# EAGLE design Dual LPF V1.2 Top (EAGLE 9.0.0)
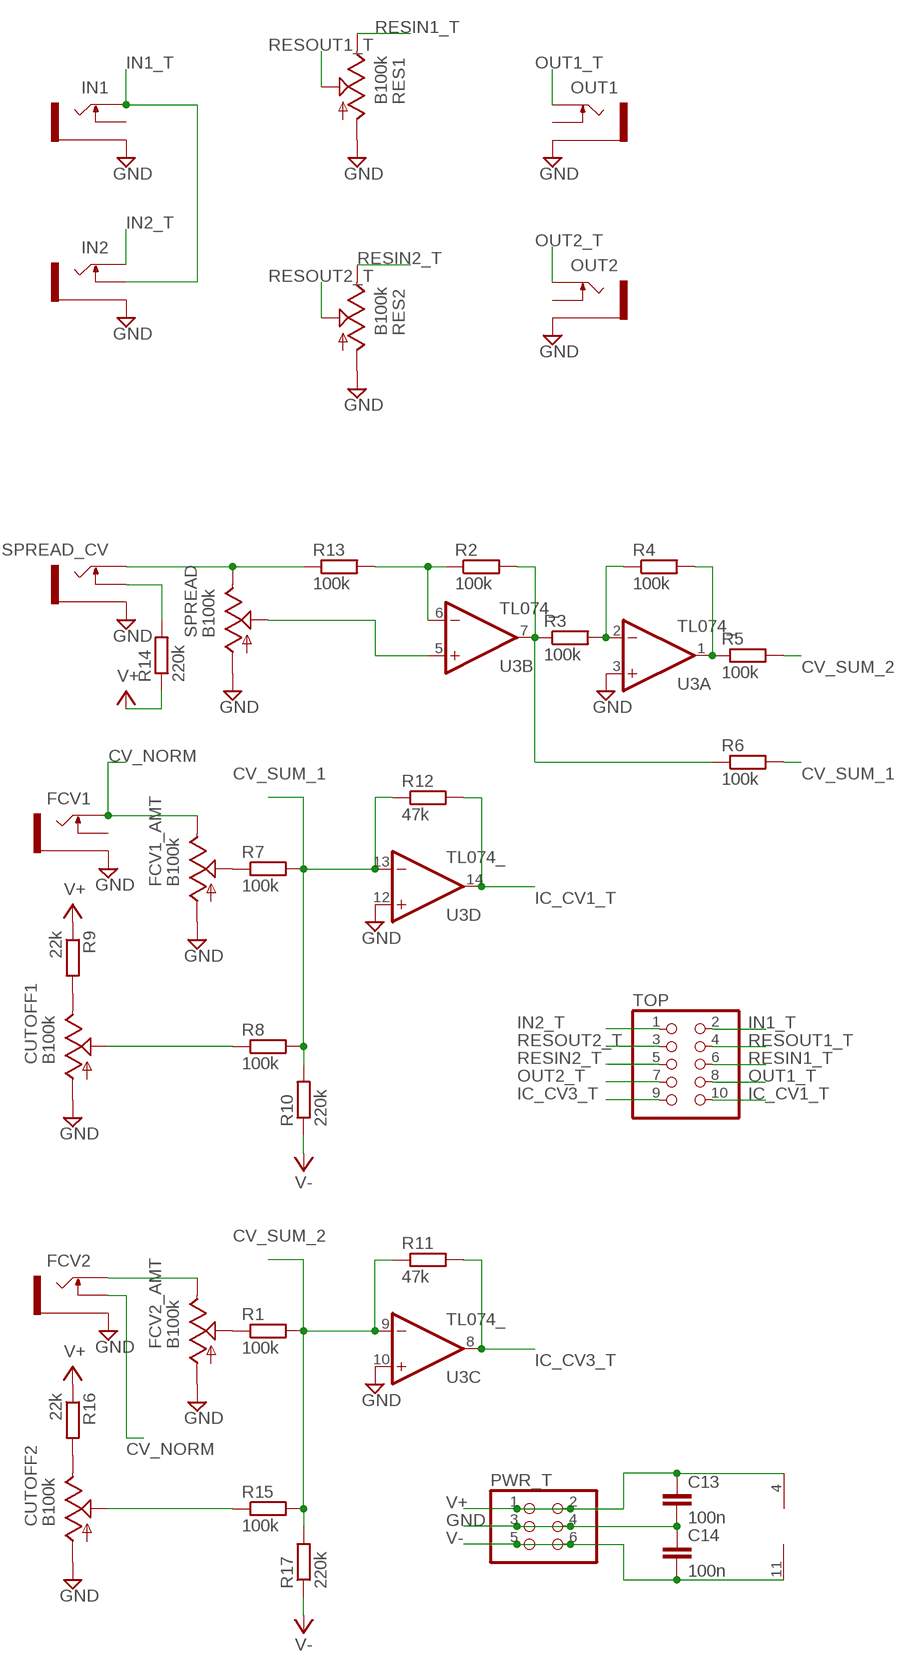
[diagram p0: schematic, sheet 1]

## Parts
C13  100n  C-EU050-024X044  [C050-024X044]
C14  100n  C-EU050-024X044  [C050-024X044]
CUTOFF1  B100k  9MM_SNAP-IN_POT_  [9MM_SNAP-IN_POT]
CUTOFF2  B100k  9MM_SNAP-IN_POT_  [9MM_SNAP-IN_POT]
FCV1  THONKICONNNEW  [WQP-PJ301M-12_JACK]
FCV1_AMT  B100k  9MM_SNAP-IN_POT_  [9MM_SNAP-IN_POT]
FCV2  THONKICONNNEW  [WQP-PJ301M-12_JACK]
FCV2_AMT  B100k  9MM_SNAP-IN_POT_  [9MM_SNAP-IN_POT]
IN1  THONKICONNNEW  [WQP-PJ301M-12_JACK]
IN2  THONKICONNNEW  [WQP-PJ301M-12_JACK]
OUT1  THONKICONNNEW  [WQP-PJ301M-12_JACK]
OUT2  THONKICONNNEW  [WQP-PJ301M-12_JACK]
PWR_T  PINHD-2X3  [2X03]
R1  100k  R-EU_0207/7  [0207/7]
R2  100k  R-EU_0207/7  [0207/7]
R3  100k  R-EU_0207/7  [0207/7]
R4  100k  R-EU_0207/7  [0207/7]
R5  100k  R-EU_0207/7  [0207/7]
R6  100k  R-EU_0207/7  [0207/7]
R7  100k  R-EU_0207/7  [0207/7]
R8  100k  R-EU_0207/7  [0207/7]
R9  22k  R-EU_0207/7  [0207/7]
R10  220k  R-EU_0207/7  [0207/7]
R11  47k  R-EU_0207/7  [0207/7]
R12  47k  R-EU_0207/7  [0207/7]
R13  100k  R-EU_0207/7  [0207/7]
R14  220k  R-EU_0207/7  [0207/7]
R15  100k  R-EU_0207/7  [0207/7]
R16  22k  R-EU_0207/7  [0207/7]
R17  220k  R-EU_0207/7  [0207/7]
RES1  B100k  9MM_SNAP-IN_POT_  [9MM_SNAP-IN_POT]
RES2  B100k  9MM_SNAP-IN_POT_  [9MM_SNAP-IN_POT]
SPREAD  B100k  9MM_SNAP-IN_POT_  [9MM_SNAP-IN_POT]
SPREAD_CV  THONKICONNNEW  [WQP-PJ301M-12_JACK]
TOP  PINHD-2X5  [2X05]
U3  TL074_  [DIL14]

## Nets
CV_NORM: FCV1.P$1_TIP(TIP) FCV1_AMT.3(E) FCV2.P$2_SWITCH(SWITCH)
CV_SUM_1: R6.2 R7.2 R8.2 R10.2 R12.1 U3.13(D:-IN)
CV_SUM_2: R1.2 R5.2 R11.1 R15.2 R17.2 U3.9(C:-IN)
GND: C13.2 C14.1 CUTOFF1.1(A) CUTOFF2.1(A) FCV1.P$3_SLEEVE(SLEEVE) FCV1_AMT.1(A) FCV2.P$3_SLEEVE(SLEEVE) FCV2_AMT.1(A) IN1.P$3_SLEEVE(SLEEVE) IN2.P$3_SLEEVE(SLEEVE) OUT1.P$3_SLEEVE(SLEEVE) OUT2.P$3_SLEEVE(SLEEVE) PWR_T.3 PWR_T.4 RES1.1(A) RES2.1(A) SPREAD.1(A) SPREAD_CV.P$3_SLEEVE(SLEEVE) U3.3(A:+IN) U3.10(C:+IN) U3.12(D:+IN)
IC_CV1_T: R12.2 TOP.10 U3.14(D:OUT)
IC_CV3_T: R11.2 TOP.9 U3.8(C:OUT)
IN1_T: IN1.P$1_TIP(TIP) IN2.P$2_SWITCH(SWITCH) TOP.2
IN2_T: IN2.P$1_TIP(TIP) TOP.1
N$1: FCV2_AMT.2(S) R1.1
N$2: R2.1 R13.2 U3.6(B:-IN)
N$3: R2.2 R3.1 R6.1 U3.7(B:OUT)
N$4: R3.2 R4.1 U3.2(A:-IN)
N$5: R4.2 R5.1 U3.1(A:OUT)
N$6: R14.2 SPREAD_CV.P$2_SWITCH(SWITCH)
N$7: SPREAD.2(S) U3.5(B:+IN)
N$8: R13.1 SPREAD.3(E) SPREAD_CV.P$1_TIP(TIP)
N$9: FCV1_AMT.2(S) R7.1
N$10: CUTOFF1.2(S) R8.1
N$12: CUTOFF1.3(E) R9.2
N$15: CUTOFF2.2(S) R15.1
N$16: CUTOFF2.3(E) R16.2
N$17: FCV2.P$1_TIP(TIP) FCV2_AMT.3(E)
OUT1_T: OUT1.P$1_TIP(TIP) TOP.8
OUT2_T: OUT2.P$1_TIP(TIP) TOP.7
RESIN1_T: RES1.3(E) TOP.6
RESIN2_T: RES2.3(E) TOP.5
RESOUT1_T: RES1.2(S) TOP.4
RESOUT2_T: RES2.2(S) TOP.3
V+: C13.1 PWR_T.1 PWR_T.2 R9.1 R14.1 R16.1 U3.4(P:V+)
V-: C14.2 PWR_T.5 PWR_T.6 R10.1 R17.1 U3.11(P:V-)
Unconnected: FCV1.P$2_SWITCH(SWITCH) IN1.P$2_SWITCH(SWITCH) OUT1.P$2_SWITCH(SWITCH) OUT2.P$2_SWITCH(SWITCH)

## Library data of the parts
C13 C14 = resistor:C-EU: CAPACITOR, European symbol
CUTOFF1 CUTOFF2 FCV1_AMT FCV2_AMT RES1 RES2 SPREAD = MusicThingModular:9MM_SNAP-IN_POT: 9mm vertical snap-in pot, Alpha / Panasonic style
FCV1 FCV2 IN1 IN2 OUT1 OUT2 SPREAD_CV = MusicThingModular:THONKICONN: 3.5mm socket for Eurorack modular synths
PWR_T = pinhead:PINHD-2X3: PIN HEADER
R1-R17 = resistor:R-EU_: RESISTOR, European symbol
TOP = pinhead:PINHD-2X5: PIN HEADER
U3 = MusicThingModular:TL074: Generic Quad Op Amp

## Board
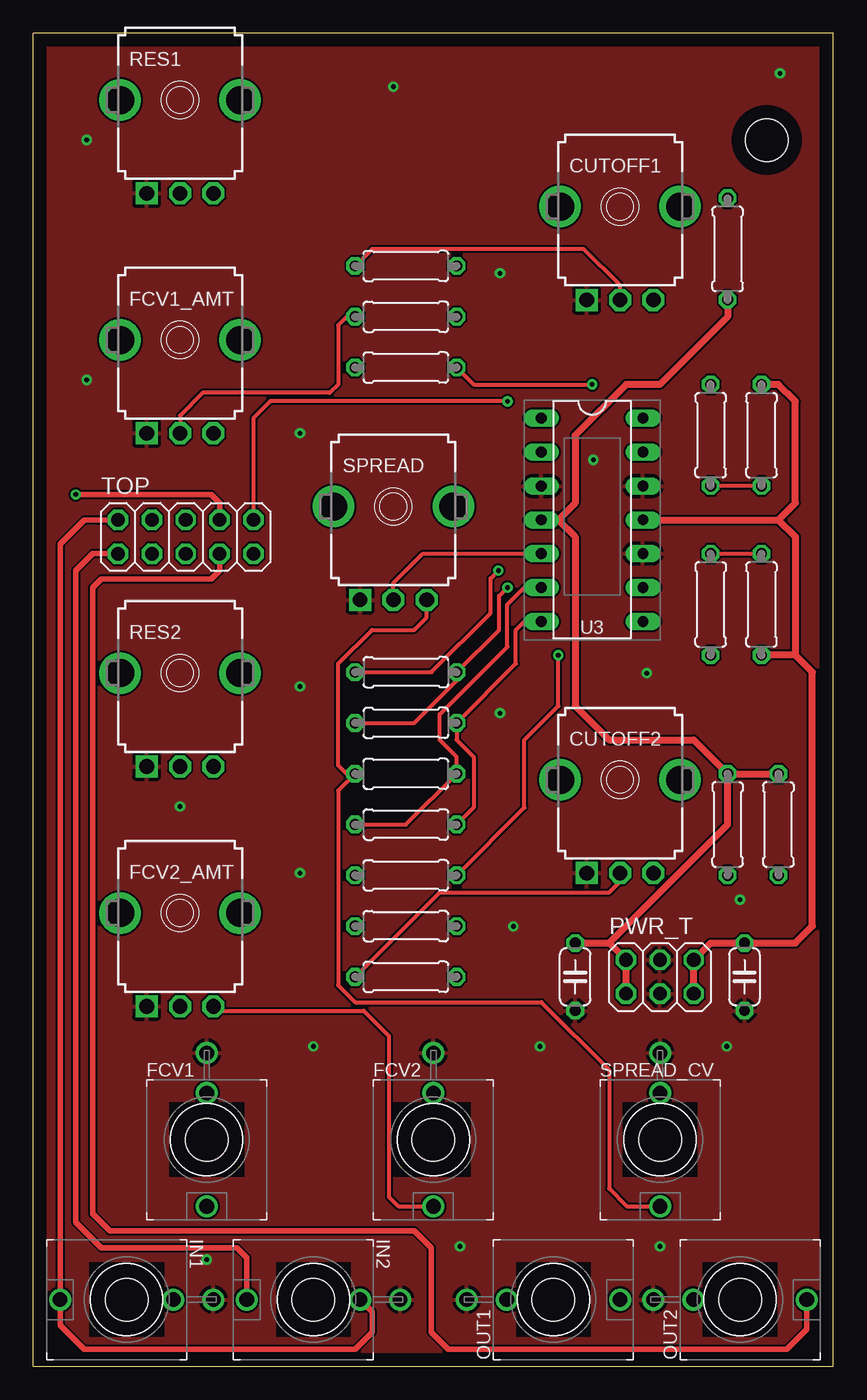
[diagram p1: board, top side]
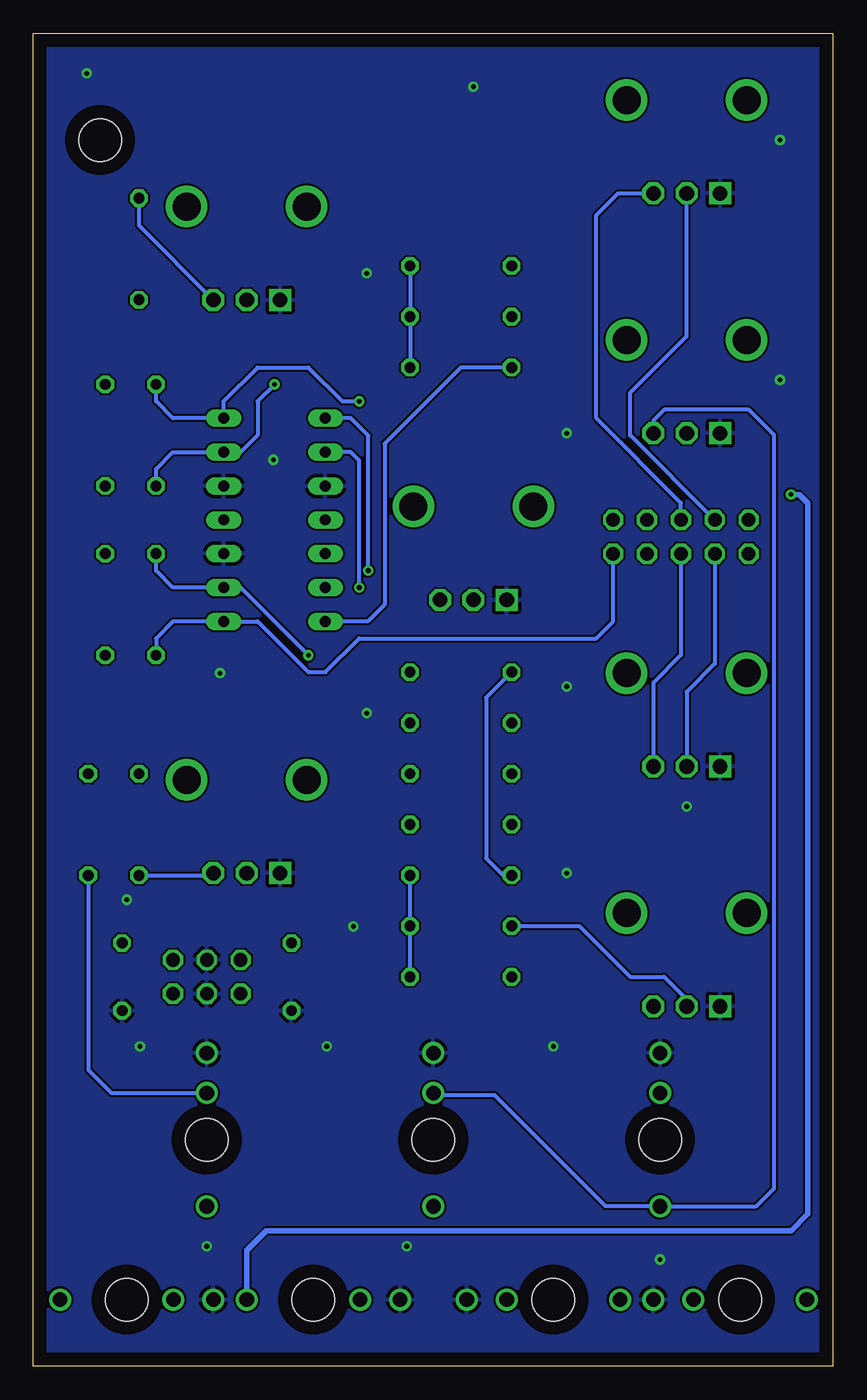
[diagram p2: board, bottom side, seen from below]

Size 60 x 100 mm. Coordinates in mm from the lower left corner, seen from the top.
Outline: 0,0 60,0 60,100 0,100 0,0
Copper layers (1*16): Top 0.035mm / dielectric 1.5mm / Bottom 0.035mm
Design rules "default": minimum track width 6mil, minimum drill 0.35mm, track to track 6mil, track to pad 6mil, pad to pad 6mil, via to via 6mil, smd to smd 6mil, copper to edge 40mil, drill to drill 6mil, minimum pad ring 10mil, minimum via ring 8mil, stop-mask expansion 4mil, vias tented up to drill 0mil, thermal gap 10mil
Holes 3.2 mm at 13,17 30,17 47,17 53,5 39,5 21,5 7,5 55,92

### Footprints (pad centres in the part's own frame; a part is rotated, then mirrored left to right if it is on the bottom)
C050-024X044 = drill 0.813 octagon: 1 -2.54,0; 2 2.54,0
9MM_SNAP-IN_POT = drill 1.1 square: 1 -2.5,-7 | drill 1.1 octagon: 2 0,-7; 3 2.5,-7 | drill 2.1 pad 2.794: CHASSIS1 -4.5,0; CHASSIS2 4.5,0
WQP-PJ301M-12_JACK = drill 1.1: P$1_TIP 0,5; P$2_SWITCH 0,-3.5; P$3_SLEEVE 0,-6.5
2X03 = drill 1.016 octagon: 1 -2.54,-1.27; 2 -2.54,1.27; 3 0,-1.27; 4 0,1.27; 5 2.54,-1.27; 6 2.54,1.27
0207/7 = drill 0.813 octagon: 1 -3.81,0; 2 3.81,0
2X05 = drill 1.016 octagon: 1 -5.08,-1.27; 2 -5.08,1.27; 3 -2.54,-1.27; 4 -2.54,1.27; 5 0,-1.27; 6 0,1.27; 7 2.54,-1.27; 8 2.54,1.27; 9 5.08,-1.27; 10 5.08,1.27
DIL14 = drill 0.813 long: 1 -7.62,-3.81; 2 -5.08,-3.81; 3 -2.54,-3.81; 4 0,-3.81; 5 2.54,-3.81; 6 5.08,-3.81; 7 7.62,-3.81; 8 7.62,3.81; 9 5.08,3.81; 10 2.54,3.81; 11 0,3.81; 12 -2.54,3.81; 13 -5.08,3.81; 14 -7.62,3.81

### Placement (x,y rotation side)
C13  40.64,29.21 270 top
C14  53.34,29.21 90 top
CUTOFF1  44,87 0 top
CUTOFF2  44,44 0 top
FCV1  13,17 180 top
FCV1_AMT  11,77 0 top
FCV2  30,17 180 top
FCV2_AMT  11,34 0 top
IN1  7,5 90 top
IN2  21,5 90 top
OUT1  39,5 270 top
OUT2  53,5 270 top
PWR_T  46.99,29.21 0 top
R1  27.94,33.02 0 top
R2  27.94,40.64 0 top
R3  27.94,48.26 180 top
R4  27.94,52.07 180 top
R5  27.94,36.83 0 top
R6  27.94,74.93 0 top
R7  27.94,78.74 0 top
R8  27.94,82.55 0 top
R9  52.07,83.82 90 top
R10  54.61,69.85 270 top
R11  50.8,57.15 270 top
R12  50.8,69.85 90 top
R13  27.94,44.45 0 top
R14  55.88,40.64 270 top
R15  27.94,29.21 0 top
R16  52.07,40.64 270 top
R17  54.61,57.15 90 top
RES1  11,95 0 top
RES2  11,52 0 top
SPREAD  27,64.5 0 top
SPREAD_CV  47,17 180 top
TOP  11.43,62.23 0 top
U3  41.91,63.5 270 top

### Tracks (layer width: path | path; a pad name or v marks a point on that pad's centre or on a via)
CV_NORM
  Bottom 0.305: FCV1_AMT.3 13.5,70.95 12.7,71.75 6.35,71.75 4.45,69.85 4.45,13.34 5.78,12 FCV1.P$1_TIP 17.08,12 25.4,20.32 29.82,20.32 FCV2.P$2_SWITCH
CV_SUM_1  (via drill 0.35)
  Top 0.305: R10.2 R12.1 | R6.2 33.02,73.66 v41.91,73.66
  Bottom 0.305: R12.1 50.8,67.31 49.53,68.58 U3.13 44.45,68.58 43.18,69.85 43.18,72.39 v41.91,73.66 | R8.2 R7.2 R6.2
CV_SUM_2  (via drill 0.35)
  Top 0.305: R11.1 R17.2 | R5.2 36.83,41.91 36.83,46.99 39.37,49.53 v39.37,53.34
  Bottom 0.305: R15.2 R1.2 R5.2 | R11.1 50.8,59.69 49.53,58.42 U3.9 44.45,58.42 v39.37,53.34
GND  (via drill 0.35)
  other vias: 21,24 38,24 52,24 47,9 32,9 13,8 11,42 4,74 4,92 56,97 35,82 35,49 46,52 20,51 20,37 36,33 53,35 20,70 27,96 42,68
  pour Top: 0,100 0,0 60,0 60,100
  pour Bottom: 0,100 0,0 60,0 60,100
IC_CV1_T  (via drill 0.35)
  Top 0.305: v35.56,72.39 17.78,72.39 16.51,71.12 TOP.10
  Bottom 0.305: R12.2 50.8,72.39 49.53,71.12 U3.14 45.72,72.39 43.18,74.93 39.37,74.93 36.83,72.39 v35.56,72.39
IC_CV3_T
  Bottom 0.305: R11.2 50.8,54.61 49.53,55.88 U3.8 43.18,55.88 39.37,52.07 38.1,52.07 35.56,54.61 17.78,54.61 16.51,55.88 TOP.9
IN1_T
  Top 0.406: IN2.P$2_SWITCH 25.4,4.1 25.4,2.54 24.13,1.27 3.81,1.27 2,3.08 IN1.P$1_TIP 2,61.69 3.81,63.5 TOP.2
IN2_T
  Top 0.406: IN2.P$1_TIP 16,8.13 15.24,8.89 5.08,8.89 3.17,10.79 3.17,59.69 4.45,60.96 TOP.1
N$1
  Bottom 0.305: R1.1 19.05,33.02 15.24,29.21 12.7,29.21 11,27.51 FCV2_AMT.2
N$2
  Top 0.305: R2.1 27.94,40.64 R13.2 31.75,45.72 30.48,46.99 30.48,48.9 35.56,53.98 35.56,57.15 36.83,58.42 U3.6
N$3
  Top 0.305: U3.7 36.83,55.88 36.2,55.24 36.2,52.7 R3.1 31.75,46.99 33.02,45.72 33.02,41.91 R2.2
  Bottom 0.305: R6.1 27.94,74.93 33.66,69.22 33.66,57.15 34.92,55.88 U3.7
N$4  (via drill 0.35)
  Top 0.305: R3.2 28.57,48.26 31.75,51.44 R4.1 34.92,55.24 34.92,57.78 v35.56,58.42
  Bottom 0.305: v35.56,58.42 35.56,67.94 36.2,68.58 U3.2
N$5  (via drill 0.35)
  Top 0.305: R4.2 29.84,52.07 34.29,56.52 34.29,59.1 v34.88,59.69
  Bottom 0.305: R4.2 26.04,50.16 26.04,38.1 24.77,36.83 R5.1 | v34.88,59.69 34.88,69.8 36.2,71.12 U3.1
N$6
  Bottom 0.305: R14.2 55.88,22.23 54.16,20.5 SPREAD_CV.P$2_SWITCH
N$7
  Top 0.305: SPREAD.2 27,58.75 29.21,60.96 U3.5
N$8
  Top 0.305: SPREAD.3 29.5,56.17 28.57,55.24 25.4,55.24 22.86,52.7 22.86,45.09 23.5,44.45 R13.1 22.86,43.18 22.86,28.57 24.13,27.3 38.1,27.3 43.18,22.23 43.18,13.34 44.52,12 SPREAD_CV.P$1_TIP
N$9
  Top 0.305: R7.1 23.5,78.74 22.86,78.11 22.86,73.66 22.23,73.03 12.7,73.03 11,71.33 FCV1_AMT.2
N$10
  Top 0.305: CUTOFF1.2 44,81.09 41.27,83.82 25.4,83.82 R8.1
N$12
  Bottom 0.305: CUTOFF1.3 52.07,85.57 R9.2
N$15
  Top 0.305: R15.1 30.48,35.56 43.18,35.56 44,36.38 CUTOFF2.2
N$16
  Bottom 0.305: R16.2 46.67,36.83 CUTOFF2.3
N$17
  Top 0.305: FCV2_AMT.3 13.83,26.67 24.77,26.67 26.67,24.77 26.67,12.7 27.37,12 FCV2.P$1_TIP
OUT1_T  (via drill 0.35)
  Top 0.406: TOP.8 13.97,64.77 13.34,65.41 v3.17,65.41
  Bottom 0.406: v3.17,65.41 2.54,65.41 1.91,64.77 1.91,11.43 3.17,10.16 42.55,10.16 44,8.71 OUT1.P$1_TIP
OUT2_T
  Top 0.406: TOP.7 13.97,59.69 13.34,59.05 5.08,59.05 4.45,58.42 4.45,11.43 5.71,10.16 28.57,10.16 29.84,8.89 29.84,2.54 31.11,1.27 56.52,1.27 58,2.75 OUT2.P$1_TIP
RESIN1_T
  Bottom 0.305: TOP.6 11.43,64.77 17.78,71.12 17.78,86.36 16.14,88 RES1.3
RESIN2_T
  Bottom 0.305: RES2.3 13.5,51.27 11.43,53.34 TOP.5
RESOUT1_T
  Bottom 0.305: TOP.4 15.24,69.85 15.24,73.03 11,77.27 RES1.2
RESOUT2_T
  Bottom 0.305: RES2.2 11,50.59 8.89,52.7 TOP.3
V+
  Top 0.508: PWR_T.1 PWR_T.2 43.18,31.75 | C13.1 43.18,31.75 | R16.1 R14.1 | 43.18,31.75 52.07,40.64 R16.1 | U3.4 39.37,63.5 | 39.37,63.5 40.64,62.23 40.64,49.53 43.18,46.99 49.53,46.99 R16.1 | R9.1 52.07,78.74 46.99,73.66 44.45,73.66 40.64,69.85 40.64,64.77 39.37,63.5
V-
  Top 0.508: PWR_T.5 PWR_T.6 50.8,31.75 C14.2 57.15,31.75 58.42,33.02 58.42,52.07 57.15,53.34 | 57.15,53.34 R17.1 | U3.11 55.88,63.5 | 55.88,63.5 57.15,62.23 57.15,53.34 | 55.88,63.5 57.15,64.77 57.15,72.39 55.88,73.66 R10.1

### Text on the board
tValues: Control Board / Dual Dreadful VCF V1.2 / Tom Evans 2019 / CC BY 4.0